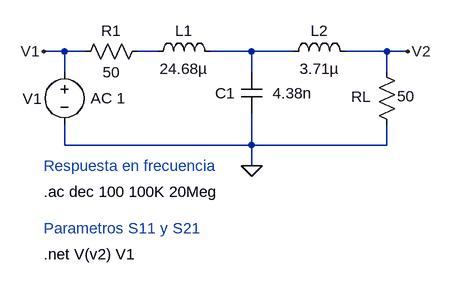
[diagram p0: schematic EJ _desnorm.asc]
EJ _desnorm.asc, the LTspice schematic file:
Version 4
SHEET 1 1076 680
WIRE -144 160 -176 160
WIRE -112 160 -144 160
WIRE 0 160 -32 160
WIRE 144 160 80 160
WIRE 208 160 144 160
WIRE 352 160 288 160
WIRE 384 160 352 160
WIRE -144 192 -144 160
WIRE 144 192 144 160
WIRE 352 192 352 160
WIRE -144 304 -144 272
WIRE 144 304 144 256
WIRE 144 304 -144 304
WIRE 352 304 352 272
WIRE 352 304 144 304
WIRE 144 336 144 304
FLAG 144 336 0
FLAG 384 160 V2
FLAG -176 160 V1
SYMBOL cap 160 256 R180
WINDOW 0 41 32 Left 2
WINDOW 3 -77 32 Left 2
SYMATTR InstName C1
SYMATTR Value 4.38n
SYMBOL res 368 288 R180
WINDOW 0 40 58 Left 2
WINDOW 3 -27 59 Left 2
SYMATTR InstName RL
SYMATTR Value 50
SYMBOL ind -16 176 R270
WINDOW 0 32 56 VTop 2
WINDOW 3 5 56 VBottom 2
SYMATTR InstName L1
SYMATTR Value 24.68µ
SYMBOL voltage -144 176 R0
WINDOW 0 -64 57 Left 2
WINDOW 123 40 56 Left 2
WINDOW 39 38 78 Left 2
SYMATTR InstName V1
SYMATTR Value2 AC 1
SYMATTR Value ""
SYMBOL ind 192 176 R270
WINDOW 0 32 56 VTop 2
WINDOW 3 5 56 VBottom 2
SYMATTR InstName L2
SYMATTR Value 3.71µ
SYMBOL res -16 144 R90
WINDOW 0 0 56 VBottom 2
WINDOW 3 32 56 VTop 2
SYMATTR InstName R1
SYMATTR Value 50
TEXT -176 376 Left 2 !.ac dec 100 100K 20Meg
TEXT -176 336 Left 2 ;Respuesta en frecuencia
TEXT -176 432 Left 2 ;Parametros S11 y S21
TEXT -176 472 Left 2 !.net V(v2) V1

The netlist it stands for:
* EJ _desnorm.asc
C1 0 N002 4.38n
RL 0 V2 50
L1 N001 N002 24.68µ
V1 V1 0 AC 1
L2 N002 V2 3.71µ
R1 N001 V1 50
.ac dec 100 100K 20Meg
* Respuesta en frecuencia
* Parametros S11 y S21
.net V(v2) V1
.backanno
.end